# EAGLE schematic SevSeg-Shield-v10 (EAGLE 6.2)
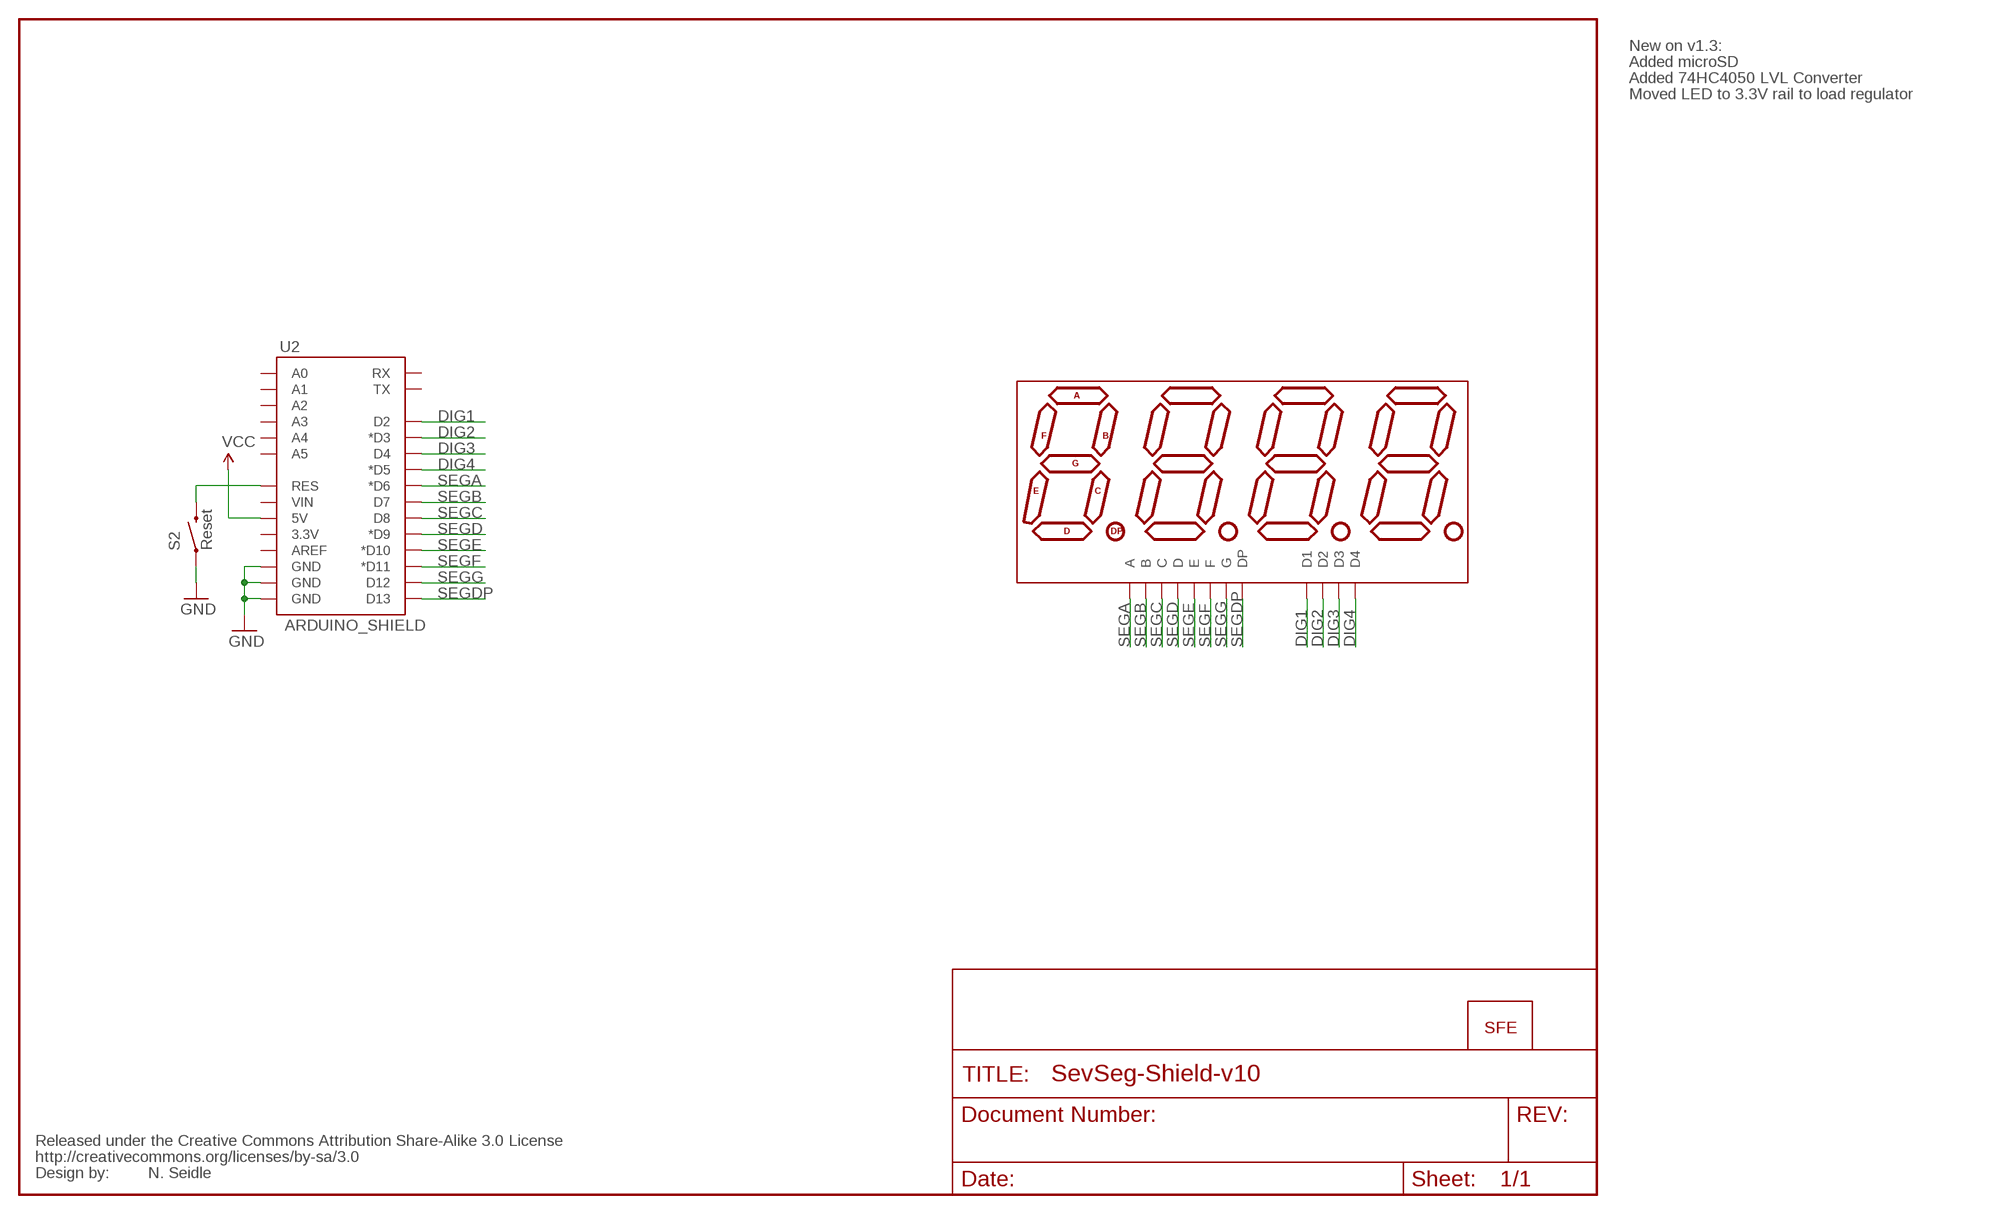
[diagram p0: schematic, sheet 1]

## Parts
S2  Reset  SWITCH-MOMENTARY-2PTH  [TACTILE-PTH]
U2  ARDUINO_SHIELD  ARDUINO_SHIELDLABEL  [DUEMILANOVE_SHIELD]
U$1  7-SEGMENT-4DIGIT-COUNTERPTH  [7-SEGMENT-4DIGIT-COUNTER]
U$3  CREATIVE_COMMONS  [CREATIVE_COMMONS]
U$7  LOGO-SFENEW  [SFE-NEW-WEBLOGO]

## Nets
ARST: S2.3 U2.RES
DIG1: U2.D2 U$1.12(D1)
DIG2: U2.D3(*D3) U$1.9(D2)
DIG3: U2.D4 U$1.8(D3)
DIG4: U2.D5(*D5) U$1.6(D4)
GND: S2.1 U2.GND@0(GND) U2.GND@1(GND) U2.GND@2(GND)
SEGA: U2.D6(*D6) U$1.11(A)
SEGB: U2.D7 U$1.7(B)
SEGC: U2.D8 U$1.4(C)
SEGD: U2.D9(*D9) U$1.2(D)
SEGDP: U2.D13 U$1.3(DP)
SEGE: U2.D10(*D10) U$1.1(E)
SEGF: U2.D11(*D11) U$1.10(F)
SEGG: U2.D12 U$1.5(G)
VCC: U2.5V
Unconnected: U2.3.3V U2.A0 U2.A1 U2.A2 U2.A3 U2.A4 U2.A5 U2.AREF U2.RX U2.TX U2.VIN

## Notes on the sheet
- New on v1.3:
- Added microSD
- Added 74HC4050 LVL Converter
- Moved LED to 3.3V rail to load regulator
- N. Seidle

## Library data of the parts
S2 = SparkFun:SWITCH-MOMENTARY-2
U2 = SparkFun:ARDUINO_SHIELD
U$1 = SparkFun-Displays:7-SEGMENT-4DIGIT-COUNTER
U$3 = SparkFun:CREATIVE_COMMONS
U$7 = SparkFun:LOGO-SFE: Spark Fun Electronics PCB Logo This is the standard Spark Fun Electronics PCB logo.